# EAGLE design turntable-vu-meters (EAGLE 6.5.0)
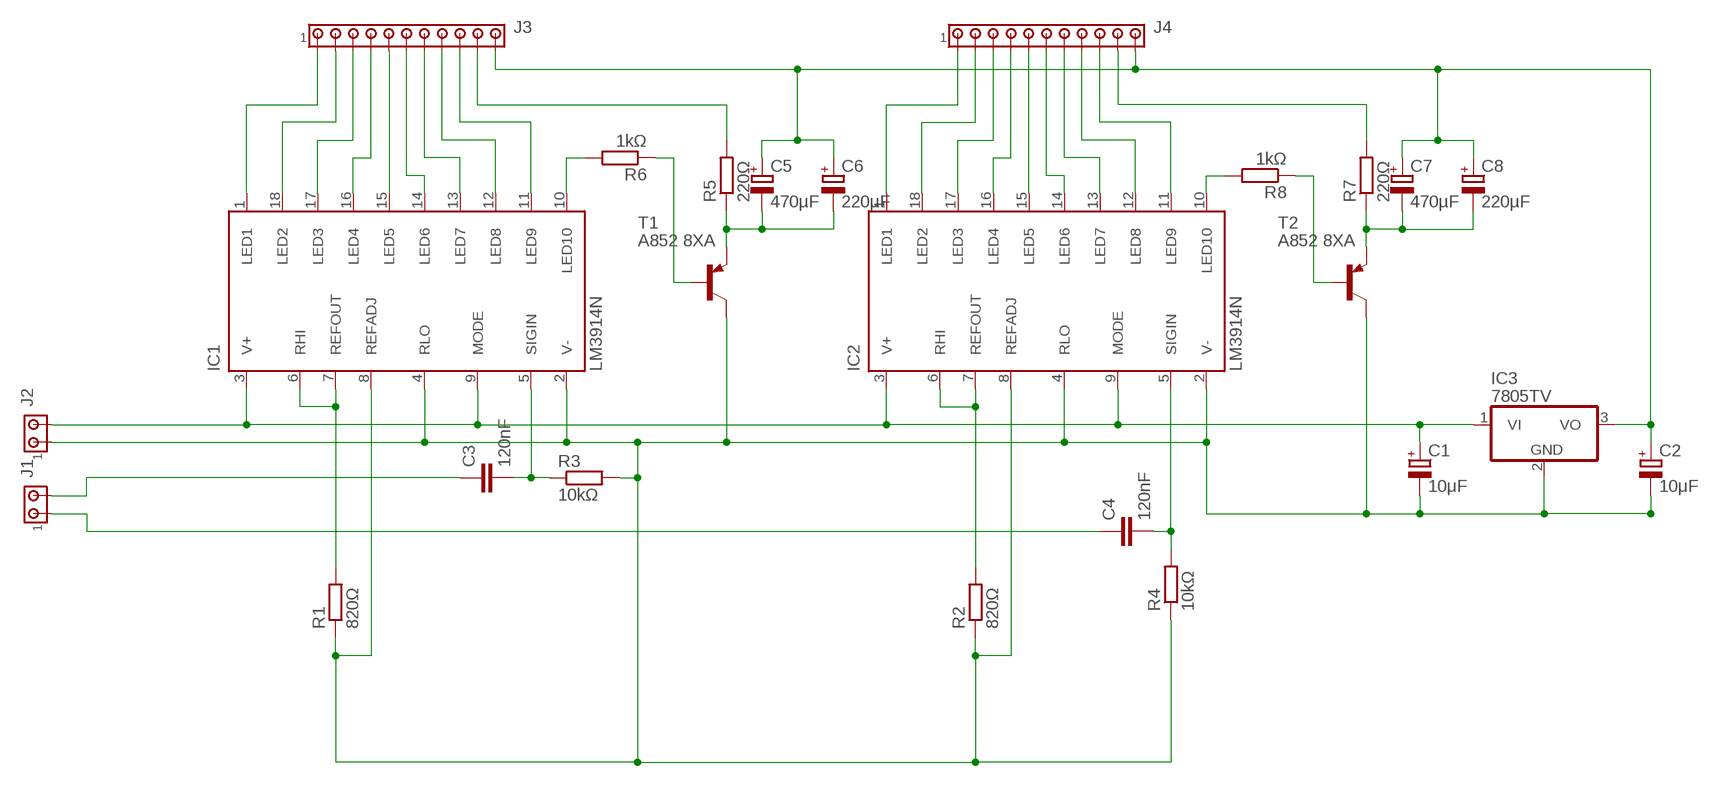
[diagram p0: schematic, sheet 1]

## Parts
C1  10μF  CPOL-EUE5-6  [E5-6]
C2  10μF  CPOL-EUE5-6  [E5-6]
C3  120nF  C-EU075-052X106  [C075-052X106]
C4  120nF  C-EU075-052X106  [C075-052X106]
C5  470µF  CPOL-EUE3.5-8  [E3,5-8]
C6  220µF  CPOL-EUE2.5-7  [E2,5-7]
C7  470µF  CPOL-EUE3.5-8  [E3,5-8]
C8  220µF  CPOL-EUE2.5-7  [E2,5-7]
IC1  LM3914N  [DIL18]
IC2  LM3914N  [DIL18]
IC3  7805TV  [TO220V]
J1  MTA02-156  [1X2MTA]
J2  MTA02-156  [1X2MTA]
J3  MTA11-156  [1X11MTA]
J4  MTA11-156  [1X11MTA]
R1  820Ω  R-EU_0204/7  [0204/7]
R2  820Ω  R-EU_0204/7  [0204/7]
R3  10kΩ  R-EU_0204/7  [0204/7]
R4  10kΩ  R-EU_0204/7  [0204/7]
R5  220Ω  R-EU_0204/7  [0204/7]
R6  1kΩ  R-EU_0204/7  [0204/7]
R7  220Ω  R-EU_0204/7  [0204/7]
R8  1kΩ  R-EU_0204/7  [0204/7]
T1  A852 8XA  -PNP-TO92  [TO92]
T2  A852 8XA  -PNP-TO92  [TO92]

## Nets
N$1: IC2.17(LED3) J4.3
N$2: IC1.18(LED2) J3.2
N$3: IC1.1(LED1) J3.1
N$4: IC2.16(LED4) J4.4
N$5: IC2.15(LED5) J4.5
N$6: J3.10 R5.2
N$7: IC1.11(LED9) J3.9
N$8: IC1.12(LED8) J3.8
N$9: IC1.13(LED7) J3.7
N$10: IC1.14(LED6) J3.6
N$11: IC2.1(LED1) J4.1
N$12: IC2.18(LED2) J4.2
N$15: C1.+ IC1.3(V+) IC1.9(MODE) IC2.3(V+) IC2.9(MODE) IC3.1(VI) J2.2
N$16: J4.10 R7.2
N$17: IC2.11(LED9) J4.9
N$18: C5.- C6.- R5.1 T1.1(E)
N$20: IC2.14(LED6) J4.6
N$21: IC1.10(LED10) R6.2
N$22: C3.2 IC1.5(SIGIN) R3.1
N$23: C4.2 IC2.5(SIGIN) R4.2
N$24: IC1.6(RHI) IC1.7(REFOUT) R1.2
N$25: IC2.6(RHI) IC2.7(REFOUT) R2.2
N$26: IC2.13(LED7) J4.7
N$27: IC2.12(LED8) J4.8
N$28: C4.1 J1.1
N$29: C3.1 J1.2
N$30: R6.1 T1.2(B)
N$31: C2.+ C5.+ C6.+ C7.+ C8.+ IC3.3(VO) J3.11 J4.11
N$33: IC2.10(LED10) R8.2
N$34: R8.1 T2.2(B)
N$35: C7.- C8.- R7.1 T2.1(E)
N$37: C1.- C2.- IC1.2(V-) IC1.4(RLO) IC1.8(REFADJ) IC2.2(V-) IC2.4(RLO) IC2.8(REFADJ) IC3.2(GND) J2.1 R1.1 R2.1 R3.2 R4.1 T1.3(C) T2.3(C)
N$38: IC1.17(LED3) J3.3
N$39: IC1.16(LED4) J3.4
N$40: IC1.15(LED5) J3.5

## Library data of the parts
C1 C2 C5-C8 = rcl:CPOL-EU: POLARIZED CAPACITOR, European symbol
C3 C4 = rcl:C-EU: CAPACITOR, European symbol
IC1 IC2 = national-semiconductor:LM391: Dot/Bar Display Driver Source: Data sheet LM3915 <http://www.national.com/ds/LM/LM3915.pdf> Data sheet LM3914 <http://www.national.com/ds/LM/LM3914.pdf>
IC3 = linear:78*: Positive VOLTAGE REGULATOR Source: http://cache.national.com/ds/LM/LM78L05.pdf http://www.fairchildsemi.com/ds/LM/LM7805.pdf
J1 J2 = con-amp:MTA02-156: AMP connector
J3 J4 = con-amp:MTA11-156: AMP connector
R1-R8 = rcl:R-EU_: RESISTOR, European symbol
T1 T2 = transistor:*-PNP-: PNP Transistror

## Board
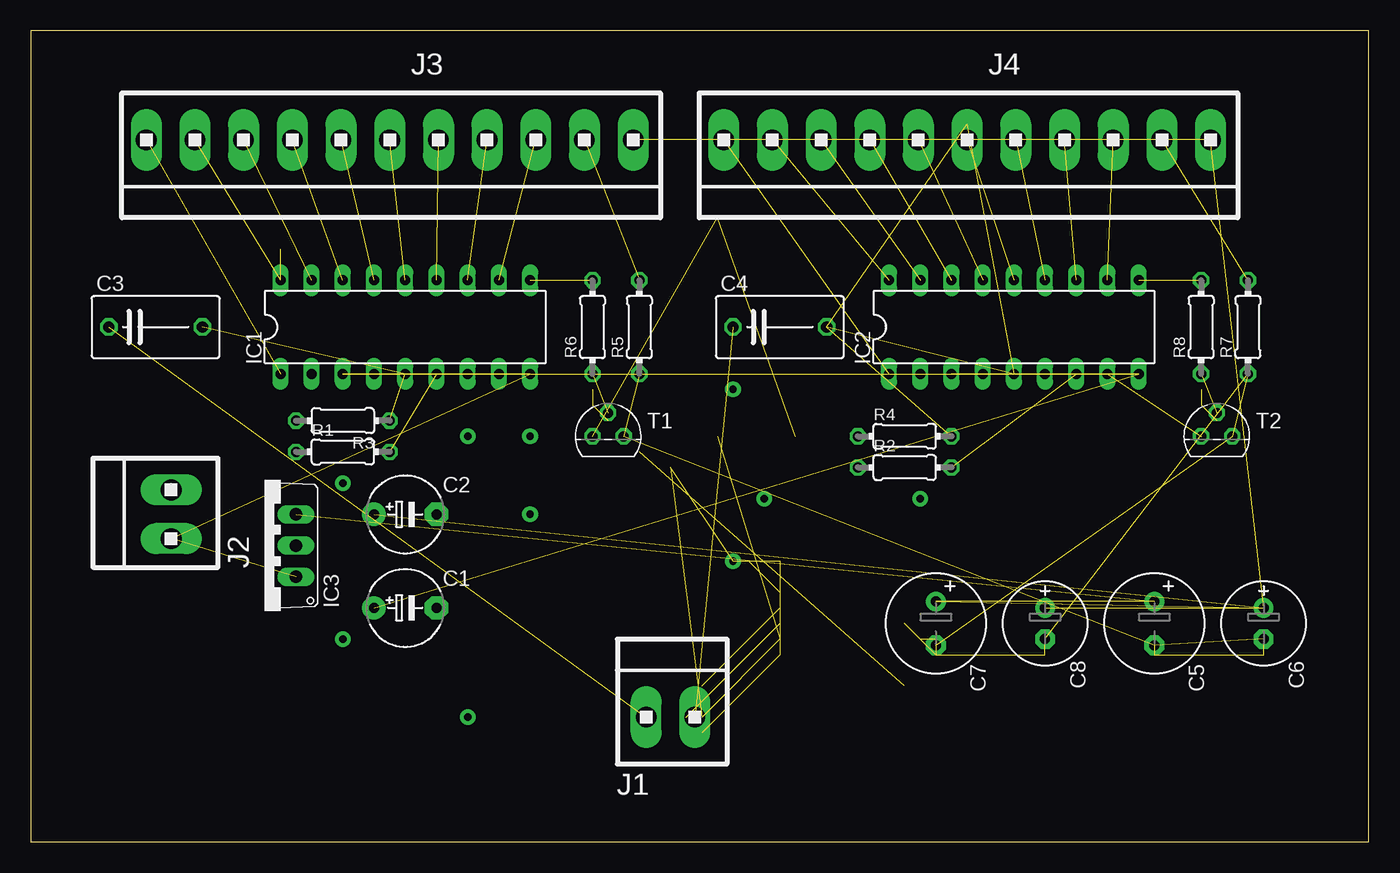
[diagram p1: board, top side]
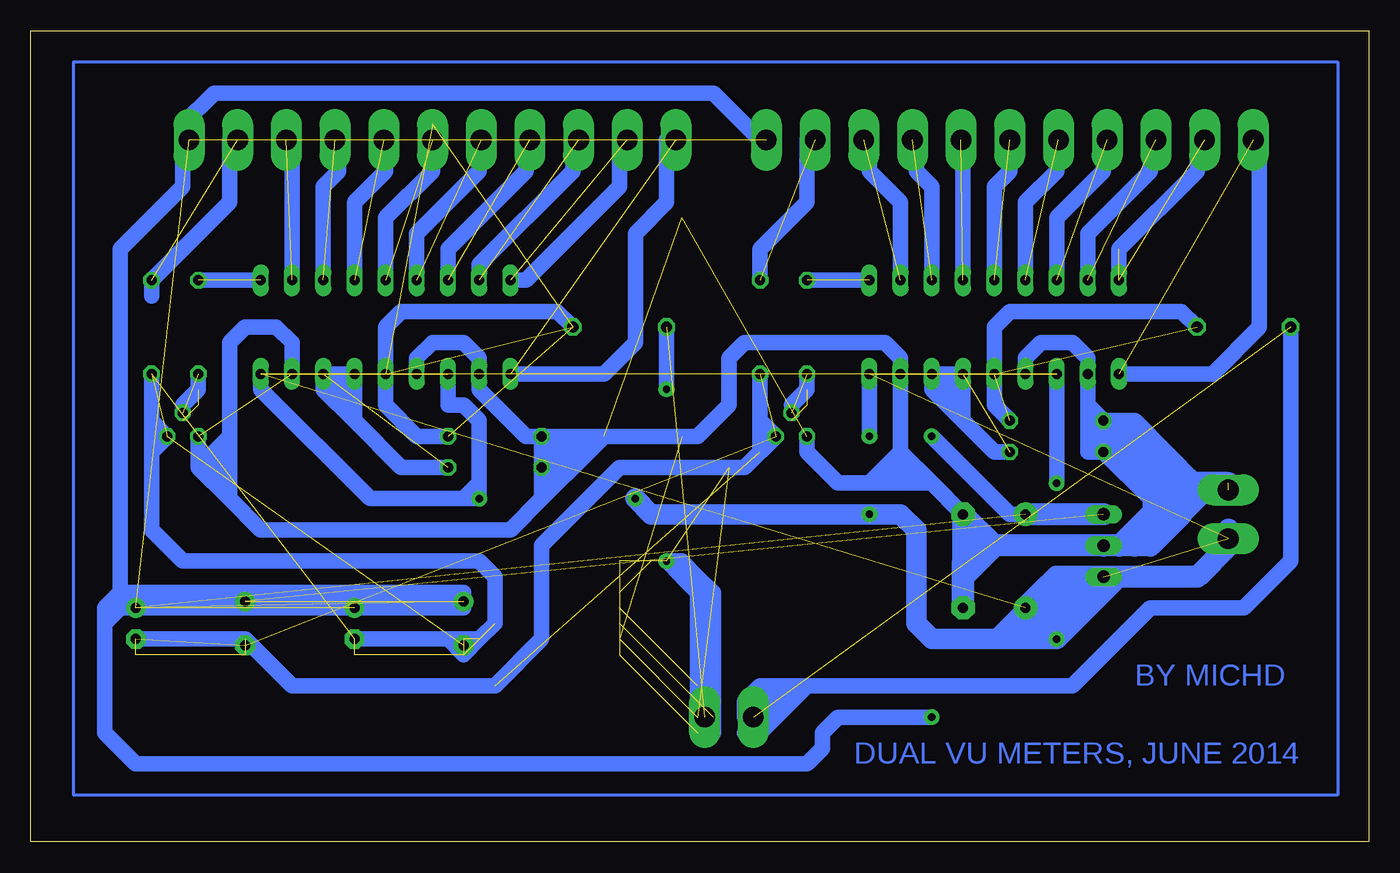
[diagram p2: board, bottom side, seen from below]

Size 108.89 x 66.03 mm. Coordinates in mm from the lower left corner, seen from the top.
Outline: 0,0 108.89,0 108.89,66.03 0,66.03 0,0
Copper layers (1*16): Top 0.035mm / dielectric 1.5mm / Bottom 0.035mm
Design rules "default": minimum track width 10mil, minimum drill 24mil, track to track 8mil, track to pad 8mil, pad to pad 8mil, via to via 8mil, smd to smd 8mil, copper to edge 40mil, drill to drill 8mil, minimum pad ring 10mil, minimum via ring 8mil, stop-mask expansion 4mil, vias tented up to drill 0mil, thermal gap 10mil

### Footprints (pad centres in the part's own frame; a part is rotated, then mirrored left to right if it is on the bottom)
E5-6 = drill 0.813 pad 1.905: + -2.54,0 | drill 0.813 pad 1.905 octagon: - 2.54,0
C075-052X106 = drill 0.914 octagon: 1 -3.81,0; 2 3.81,0
E3,5-8 = drill 0.813 pad 1.6: + -1.778,0 | drill 0.813 pad 1.6 octagon: - 1.778,0
E2,5-7 = drill 0.813 pad 1.6: + -1.27,0 | drill 0.813 pad 1.6 octagon: - 1.27,0
DIL18 = drill 0.813 long: 1 -10.16,-3.81; 2 -7.62,-3.81; 3 -5.08,-3.81; 4 -2.54,-3.81; 5 0,-3.81; 6 2.54,-3.81; 7 5.08,-3.81; 8 7.62,-3.81; 9 10.16,-3.81; 10 10.16,3.81; 11 7.62,3.81; 12 5.08,3.81; 13 2.54,3.81; 14 0,3.81; 15 -2.54,3.81; 16 -5.08,3.81; 17 -7.62,3.81; 18 -10.16,3.81
TO220V = drill 1.016 long: 1 -2.54,-2.54; 2 0,-2.54; 3 2.54,-2.54
1X2MTA = drill 1.676 long: 1 1.981,0; 2 -1.981,0
1X11MTA = drill 1.676 long: 1 19.812,0; 2 15.85,0; 3 11.887,0; 4 7.925,0; 5 3.962,0; 6 0,0; 7 -3.962,0; 8 -7.925,0; 9 -11.887,0; 10 -15.85,0; 11 -19.812,0
0204/7 = drill 0.813 octagon: 1 -3.81,0; 2 3.81,0
TO92 = drill 0.813 octagon: 1 1.27,0; 2 0,1.905; 3 -1.27,0

### Placement (x,y rotation side)
C1  30.48,19.05 0 top
C2  30.48,26.67 0 top
C3  10.16,41.91 0 top
C4  60.96,41.91 0 top
C5  91.44,17.78 270 top
C6  100.33,17.78 270 top
C7  73.66,17.78 270 top
C8  82.55,17.78 270 top
IC1  30.48,41.91 0 top
IC2  80.01,41.91 0 top
IC3  19.05,24.13 90 top
J1  52.07,10.16 0 top
J2  11.43,26.67 90 top
J3  29.21,57.15 180 top
J4  76.2,57.15 180 top
R1  25.4,31.75 0 top
R2  71.12,30.48 0 top
R3  25.4,34.29 180 top
R4  71.12,33.02 0 top
R5  49.53,41.91 90 top
R6  45.72,41.91 90 top
R7  99.06,41.91 90 top
R8  95.25,41.91 90 top
T1  46.99,33.02 0 top
T2  96.52,33.02 0 top

### Tracks (layer width: path | path; a pad name or v marks a point on that pad's centre or on a via)
N$1  (1 unrouted)
  Bottom 1.27: 64.77,57.15 64.77,54.61 72.39,46.99 IC2.17
N$2  (2 unrouted)
  Bottom 1.27: 13.97,57.15 13.97,54.61 20.32,48.26 IC1.18
N$3  (1 unrouted)
  Bottom 1.27: 8.89,57.15 8.89,41.91 12.7,38.1 IC1.1
N$4  (1 unrouted)
  Bottom 1.27: 68.58,57.15 68.58,54.61 74.93,48.26 IC2.16
N$5  (1 unrouted)
  Bottom 1.27: 72.39,57.15 72.39,54.61 77.47,49.53 IC2.15
N$6  (1 unrouted)
  Bottom 1.27: R5.2 49.53,48.26 45.72,52.07 45.72,57.15
N$7  (1 unrouted)
  Bottom 1.27: IC1.11 38.1,52.07 40.64,54.61 40.64,57.15
N$8  (1 unrouted)
  Bottom 1.27: IC1.12 35.56,53.34 36.83,54.61 36.83,57.15
N$9  (1 unrouted)
  Bottom 1.27: 33.02,57.15 IC1.13
N$10  (1 unrouted)
  Bottom 1.27: J3.6 29.21,54.61 30.48,53.34 IC1.14
N$11  (1 unrouted)
  Bottom 1.27: IC2.1 62.23,38.1 59.69,40.64 59.69,49.53 57.15,52.07 57.15,57.15
N$12  (1 unrouted)
  Bottom 1.27: IC2.18 68.58,45.72 60.96,53.34 60.96,57.15
N$13
  Bottom 1.27: 99.06,44.45 99.06,45.72 92.71,52.07 92.71,57.15
N$14
  Bottom 1.27: 49.53,57.15 53.34,60.96 93.98,60.96 96.52,58.42
N$15  (via drill 0.6 pad 1.27)  (6 unrouted)
  Bottom 1.27: 58.42,26.67 v40.64,26.67 38.1,26.67 | IC1.3 v25.4,29.21 | v25.4,16.51 25.4,17.78 IC3.1 21.59,20.32 v25.4,16.51 | 22.86,21.59 25.4,19.05 | v25.4,16.51 25.4,19.05 | 25.4,21.59 25.4,19.05 | 25.4,19.05 26.67,20.32 | IC2.3 74.93,35.56 73.66,35.56 72.39,34.29 72.39,29.21 | 35.56,16.51 30.48,16.51 | v25.4,16.51 26.67,17.78 | 26.67,17.78 C1.+ | C1.+ 25.4,19.05 | 25.4,19.05 26.67,17.78 | C1.+ 30.48,16.51 | 30.48,16.51 29.21,16.51 | 27.94,17.78 26.67,16.51 | IC2.9 90.17,36.83 81.28,27.94 73.66,27.94 | 73.66,27.94 72.39,29.21 | 72.39,29.21 v72.39,27.94 73.66,27.94 | v40.64,33.02 IC1.9
  Bottom 1.676: 27.94,16.51 29.21,16.51 | 29.21,16.51 35.56,16.51 36.83,17.78 36.83,25.4 38.1,26.67 58.42,26.67 v59.69,27.94 | 26.67,16.51 v25.4,16.51 20.32,21.59 | IC3.1 26.67,16.51 | 26.67,16.51 27.94,16.51 | 27.94,16.51 22.86,21.59 | 25.4,21.59 25.4,20.32 | 25.4,20.32 27.94,17.78 29.21,16.51 | 25.4,20.32 24.13,21.59
  Bottom 1.778: 11.43,25.4 11.43,24.13 13.97,21.59 20.32,21.59 IC3.1 22.86,21.59 24.13,21.59 25.4,21.59 26.67,20.32 C1.+
N$16  (1 unrouted)
N$17  (1 unrouted)
  Bottom 1.27: 87.63,57.15 IC2.11
N$18  (7 unrouted)
  Bottom 1.27: R5.1 49.53,34.29 | C6.- 91.44,16.51 87.63,12.7 71.12,12.7 67.31,16.51 67.31,24.13 60.96,30.48 50.8,30.48 T1.1 | T1.1 49.53,31.75 49.53,34.29 | T1.1 49.53,34.29
N$19
  Bottom 0.254: 2.54,63.5 2.54,3.81 105.41,3.81 105.41,63.5 2.54,63.5
N$20  (1 unrouted)
  Bottom 1.27: J4.6 76.2,54.61 80.01,50.8 80.01,48.26 IC2.14
N$21  (1 unrouted)
  Bottom 1.27: IC1.10 R6.2
N$22  (2 unrouted)
  Bottom 1.27: C3.2 15.24,43.18 29.21,43.18 30.48,41.91 IC1.5 30.48,35.56 R3.1
N$23  (4 unrouted)
  Bottom 1.27: R4.2 77.47,33.02 80.01,35.56 IC2.5 80.01,41.91 78.74,43.18 66.04,43.18 C4.2
N$24  (2 unrouted)
  Bottom 1.27: R1.2 30.48,31.75 33.02,34.29 | 33.02,34.29 33.02,35.56 | 33.02,34.29 35.56,36.83 IC1.7 | IC1.6 33.02,35.56 | 33.02,35.56 34.29,36.83 | 34.29,36.83 IC1.7 | IC1.7 IC1.6 | IC1.6 34.29,36.83
N$25  (2 unrouted)
  Bottom 1.27: R2.2 78.74,30.48 82.55,34.29 | 82.55,35.56 IC2.6 | IC2.7 85.09,36.83 82.55,34.29 | 82.55,34.29 82.55,35.56 | 82.55,35.56 83.82,36.83 | 83.82,36.83 IC2.7 | IC2.7 IC2.6 | IC2.6 83.82,36.83
N$26  (1 unrouted)
  Bottom 1.27: 80.01,57.15 80.01,54.61 82.55,52.07 IC2.13
N$27  (1 unrouted)
  Bottom 1.27: 83.82,57.15 83.82,54.61 85.09,53.34 IC2.12
N$28  (via drill 0.6 pad 1.27)  (1 unrouted)
  Bottom 1.27: C4.1 v57.15,36.83
N$29  (1 unrouted)
  Bottom 1.27: C3.1 6.35,22.86 10.16,19.05 17.78,19.05 24.13,12.7 45.72,12.7 | 45.72,12.7 46.99,12.7 | 46.99,12.7 49.53,10.16 50.8,10.16 | 46.99,12.7 48.26,12.7 | 48.26,12.7 49.53,12.7 50.8,11.43 50.8,10.16 | 50.8,10.16 48.26,12.7 | 48.26,12.7 48.26,11.43 50.8,8.89 49.53,8.89 45.72,12.7
N$30  (3 unrouted)
  Bottom 1.27: R6.1 45.72,36.83 46.99,35.56
N$31  (via drill 0.6 pad 1.27)  (7 unrouted)
  Bottom 1.27: v35.56,10.16 43.18,10.16 44.45,8.89 44.45,7.62 45.72,6.35 100.33,6.35 102.87,8.89 102.87,17.78 | 96.52,57.15 96.52,53.34 101.6,48.26 101.6,20.32 | 101.6,20.32 C6.+ | C6.+ C8.+ 81.28,19.05 73.66,19.05 73.66,20.32 101.6,20.32 | C2.+ 29.21,26.67 v35.56,33.02 | 102.87,17.78 102.87,19.05 | 102.87,19.05 101.6,20.32 | 102.87,19.05 C6.+ | C6.+ 101.6,19.05 102.87,17.78
  Bottom 1.778: IC3.3 C2.+
N$33  (1 unrouted)
  Bottom 1.27: IC2.10 R8.2
N$34  (3 unrouted)
  Bottom 1.27: R8.1 95.25,36.83 96.52,35.56
N$35  (8 unrouted)
  Bottom 1.27: 99.06,34.29 R7.1 | C8.- 74.93,16.51 | 74.93,16.51 72.39,16.51 | 99.06,31.75 99.06,25.4 96.52,22.86 72.39,22.86 71.12,21.59 71.12,17.78 72.39,16.51 | 99.06,31.75 T2.1 99.06,34.29 | 99.06,34.29 99.06,31.75 | 72.39,16.51 73.66,15.24 74.93,16.51
N$36  (via drill 0.6 pad 1.27)  (15 unrouted)
  Bottom 1.27: 54.61,8.89 54.61,10.16 | 54.61,10.16 54.61,12.7 | 54.61,12.7 53.34,11.43 | 53.34,8.89 53.34,10.16 | 54.61,21.59 55.88,22.86 v57.15,22.86 55.88,21.59 | 53.34,19.05 53.34,17.78 | 53.34,17.78 53.34,16.51 | 53.34,16.51 53.34,15.24 | 53.34,15.24 53.34,13.97 | 53.34,13.97 53.34,12.7 | 53.34,12.7 53.34,10.16 | 53.34,10.16 54.61,10.16 | 54.61,12.7 54.61,13.97 | 54.61,13.97 54.61,15.24 | 54.61,15.24 54.61,16.51 | 54.61,16.51 54.61,17.78 | 54.61,17.78 54.61,19.05 | 54.61,19.05 53.34,20.32 | 53.34,20.32 53.34,19.05 | 53.34,19.05 54.61,17.78 | 53.34,16.51 54.61,15.24 | 54.61,15.24 53.34,15.24 | 54.61,13.97 53.34,13.97 | 53.34,13.97 54.61,12.7 | 54.61,12.7 53.34,12.7 | 53.34,12.7 54.61,13.97 | 54.61,13.97 53.34,15.24 | 53.34,15.24 54.61,16.51 | 54.61,16.51 53.34,17.78 | 53.34,17.78 54.61,19.05 | 54.61,19.05 53.34,19.05 | 53.34,19.05 54.61,20.32 | 54.61,20.32 53.34,20.32 | 53.34,20.32 54.61,21.59 | 54.61,21.59 55.88,21.59 | 55.88,21.59 54.61,20.32 | 54.61,20.32 54.61,19.05 | 54.61,17.78 53.34,16.51
N$37  (5 unrouted)
  Bottom 1.27: C2.- 35.56,29.21 | T1.3 45.72,31.75 43.18,29.21 40.64,29.21 | R3.2 20.32,34.29 | 20.32,34.29 19.05,34.29 16.51,31.75 | 13.97,29.21 15.24,30.48 | 15.24,30.48 15.24,29.21 15.24,27.94 | 15.24,30.48 16.51,31.75 | 16.51,31.75 16.51,30.48 | 16.51,30.48 16.51,29.21 | 16.51,29.21 16.51,27.94 | 16.51,27.94 16.51,26.67 | 16.51,26.67 16.51,25.4 | R4.1 68.58,33.02 72.39,36.83 IC2.2 72.39,39.37 73.66,40.64 76.2,40.64 77.47,39.37 IC2.4 | R4.1 66.04,33.02 | 66.04,33.02 64.77,33.02 | 22.86,35.56 IC1.2 22.86,39.37 24.13,40.64 26.67,40.64 27.94,39.37 IC1.4 | 20.32,31.75 19.05,31.75 | 17.78,31.75 16.51,31.75 | R3.2 22.86,35.56 | 22.86,35.56 22.86,31.75 R1.1 | R1.1 21.59,33.02 20.32,34.29 | 20.32,34.29 17.78,31.75 | 19.05,31.75 20.32,33.02 | 20.32,33.02 R3.2 | R3.2 R1.1 | R1.1 20.32,33.02 | 16.51,29.21 19.05,31.75 | 19.05,31.75 17.78,31.75 | 17.78,31.75 16.51,30.48 | 16.51,27.94 20.32,31.75 | 20.32,31.75 R1.1 | R1.1 17.78,27.94 | 17.78,27.94 16.51,26.67 | 17.78,24.13 17.78,25.4 | 17.78,25.4 17.78,26.67 | 17.78,26.67 17.78,27.94 | 17.78,25.4 19.05,24.13 19.05,25.4 | 19.05,25.4 17.78,26.67 | 19.05,25.4 20.32,24.13 | 38.1,31.75 IC1.8 38.1,39.37 39.37,40.64 50.8,40.64 52.07,39.37 52.07,35.56 54.61,33.02 62.23,33.02 | 38.1,31.75 35.56,29.21 | 35.56,29.21 36.83,29.21 | 38.1,29.21 39.37,29.21 | R2.1 67.31,31.75 | R4.1 67.31,31.75 | 67.31,31.75 66.04,33.02 | 66.04,33.02 66.04,31.75 R2.1 | R2.1 64.77,33.02 | 64.77,33.02 63.5,33.02 | T2.3 95.25,30.48 | 95.25,30.48 92.71,27.94 | 92.71,27.94 90.17,25.4 69.85,25.4 67.31,27.94 | 67.31,27.94 67.31,29.21 | 67.31,29.21 R2.1 | R2.1 66.04,30.48 | 66.04,30.48 63.5,33.02 | 63.5,33.02 63.5,31.75 | 63.5,31.75 67.31,27.94 | 63.5,31.75 62.23,33.02
  Bottom 1.27: 62.23,33.02 63.5,33.02 | 66.04,30.48 67.31,29.21 | 38.1,31.75 39.37,30.48 | 39.37,30.48 40.64,29.21 | 40.64,29.21 39.37,29.21 | 39.37,29.21 38.1,30.48 36.83,29.21 | 36.83,29.21 38.1,29.21 | 38.1,29.21 39.37,30.48 | IC2.8 87.63,40.64 88.9,41.91 91.44,41.91 92.71,40.64 92.71,33.02 | 92.71,30.48 92.71,29.21 | 92.71,29.21 92.71,27.94 | 95.25,30.48 92.71,33.02 | 92.71,33.02 92.71,31.75 | 92.71,30.48 93.98,30.48 | 93.98,30.48 92.71,31.75 | 92.71,31.75 92.71,30.48 | 92.71,29.21 93.98,30.48
  Bottom 1.676: 15.24,26.67 12.7,29.21 15.24,29.21 20.32,24.13 | 19.05,24.13 15.24,27.94 16.51,29.21
  Bottom 1.778: 11.43,29.21 12.7,29.21 13.97,29.21 15.24,27.94 15.24,26.67 16.51,25.4 17.78,24.13 19.05,24.13 20.32,24.13 IC3.2 30.48,24.13 | 30.48,24.13 C2.- C1.- | 30.48,24.13 33.02,21.59 C1.- | C1.- 33.02,22.86 31.75,24.13
N$38  (1 unrouted)
  Bottom 1.27: 17.78,57.15 17.78,54.61 22.86,49.53 IC1.17
N$39  (1 unrouted)
  Bottom 1.27: 21.59,57.15 21.59,54.61 25.4,50.8 IC1.16
N$40  (1 unrouted)
  Bottom 1.27: 25.4,57.15 25.4,54.61 27.94,52.07 IC1.15

### Text on the board
Bottom: BY MICHD | DUAL VU METERS, JUNE 2014